# EAGLE design RFBoardLayoutGen0_v03.1routing (EAGLE 7.5.0)
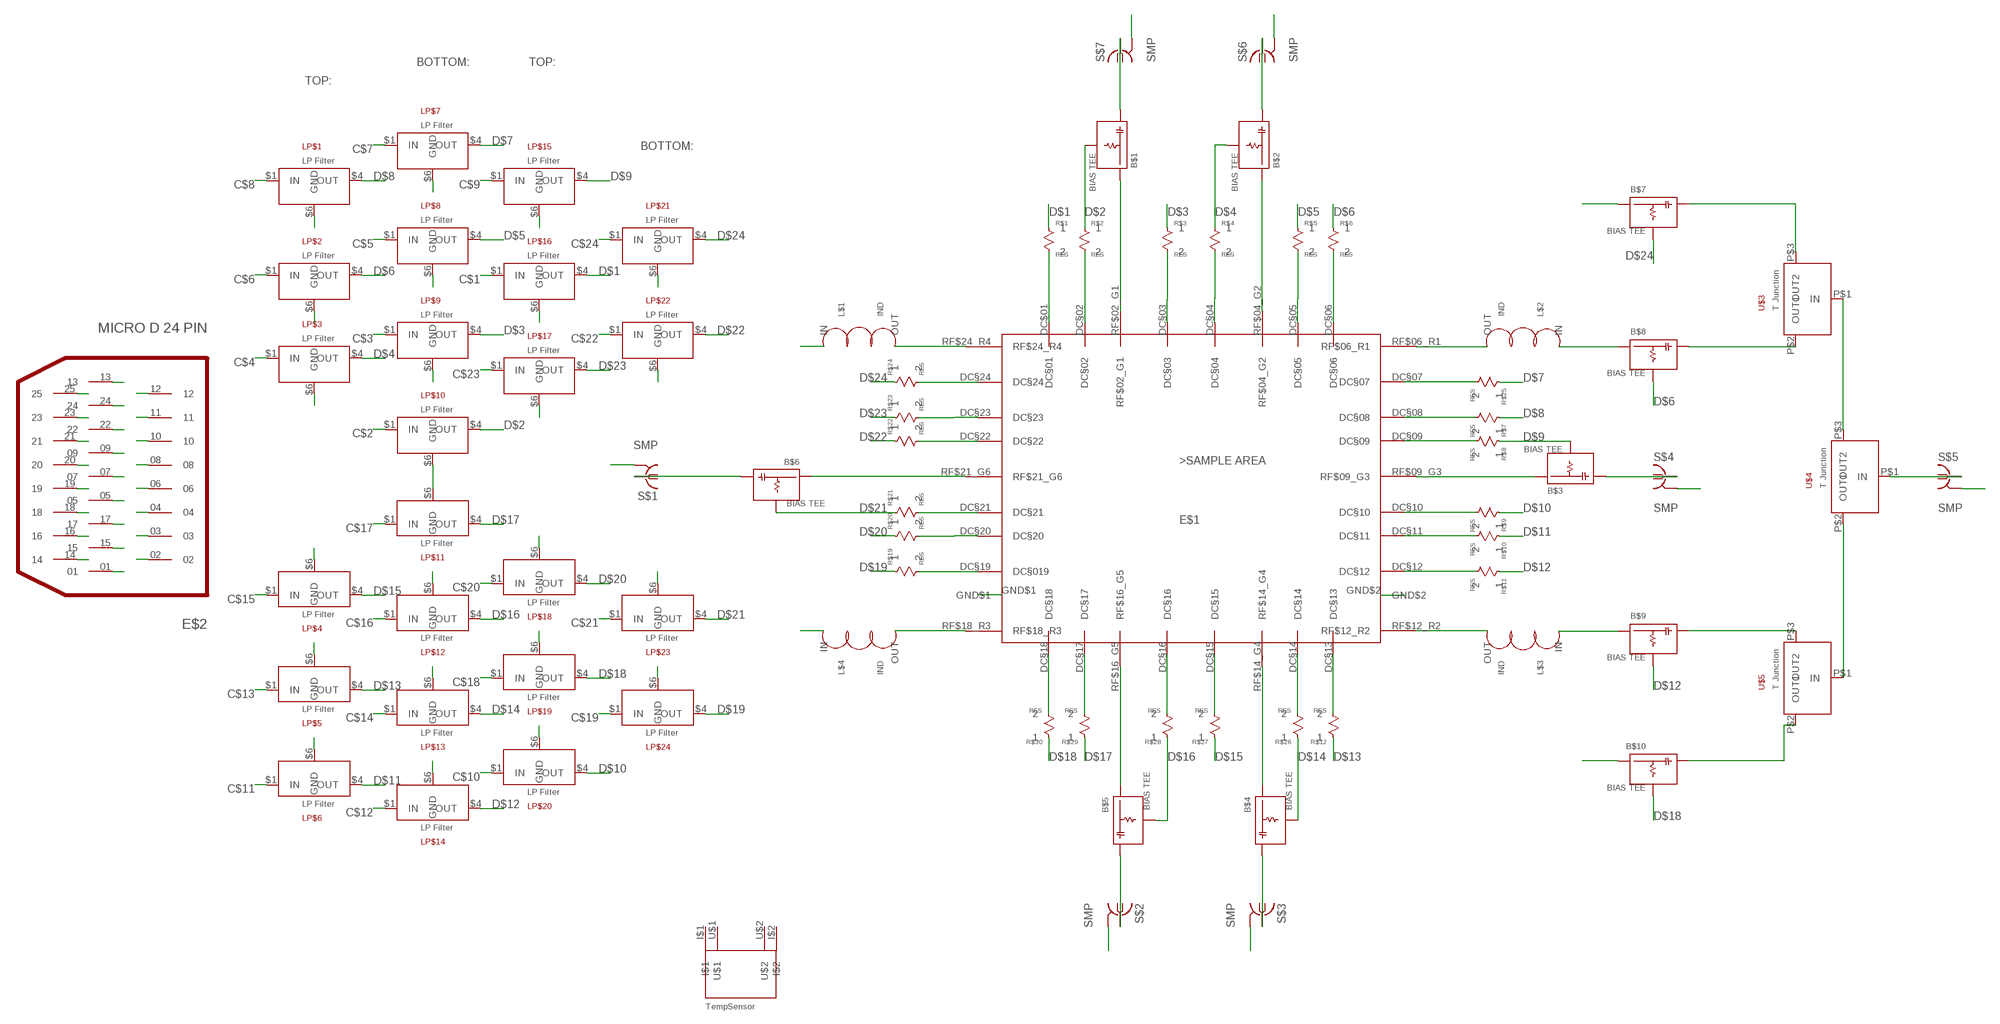
[diagram p0: schematic, sheet 1, part 1 of 2]
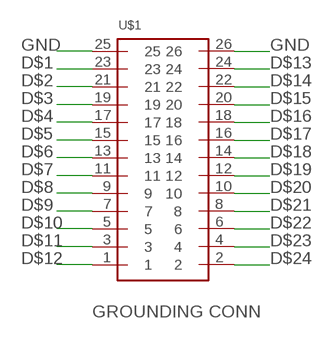
[diagram p1: schematic, sheet 1, part 2 of 2]

## Parts
B$1  BIASTEEDOWN  [BIAS_TEE_DOWN_0603]
B$2  BIASTEEUP  [BIAS_TEE_UP_0603]
B$3  BIASTEEDOWN  [BIAS_TEE_DOWN_0603]
B$4  BIASTEEDOWN  [BIAS_TEE_DOWN_0603]
B$5  BIASTEEUP  [BIAS_TEE_UP_0603]
B$6  BIASTEEDOWN  [BIAS_TEE_DOWN_0603]
B$7  BIASTEEUP  [BIAS_TEE_UP_0603]
B$8  BIASTEEDOWN  [BIAS_TEE_DOWN_0603]
B$9  BIASTEEUP  [BIAS_TEE_UP_0603]
B$10  BIASTEEDOWN  [BIAS_TEE_DOWN_0603]
E$1  24DC+10RF  [24DC+10RF/400MU-PADS/0.7X0.7_V1.0]
E$2  25_SOCKET_M83513(13-DPINOUT2  [25_SOCKET_M83513/13-D_V2]
L$1  L_MATCH  [L_MATCH]
L$2  L_MATCH  [L_MATCH]
L$3  L_MATCH  [L_MATCH]
L$4  L_MATCH  [L_MATCH]
LP$1  LP-FILTER/1-STAGETOP  [LP-FILTER/1_STAGE/OS/0603_TOP]
LP$2  LP-FILTER/1-STAGETOP  [LP-FILTER/1_STAGE/OS/0603_TOP]
LP$3  LP-FILTER/1-STAGETOP  [LP-FILTER/1_STAGE/OS/0603_TOP]
LP$4  LP-FILTER/1-STAGETOP  [LP-FILTER/1_STAGE/OS/0603_TOP]
LP$5  LP-FILTER/1-STAGETOP  [LP-FILTER/1_STAGE/OS/0603_TOP]
LP$6  LP-FILTER/1-STAGETOP  [LP-FILTER/1_STAGE/OS/0603_TOP]
LP$7  LP-FILTER/1-STAGEBOT  [LP-FILTER/1_STAGE/OS/0603_BOTTOM]
LP$8  LP-FILTER/1-STAGEBOT  [LP-FILTER/1_STAGE/OS/0603_BOTTOM]
LP$9  LP-FILTER/1-STAGEBOT  [LP-FILTER/1_STAGE/OS/0603_BOTTOM]
LP$10  LP-FILTER/1-STAGEBOT  [LP-FILTER/1_STAGE/OS/0603_BOTTOM]
LP$11  LP-FILTER/1-STAGEBOT  [LP-FILTER/1_STAGE/OS/0603_BOTTOM]
LP$12  LP-FILTER/1-STAGEBOT  [LP-FILTER/1_STAGE/OS/0603_BOTTOM]
LP$13  LP-FILTER/1-STAGEBOT  [LP-FILTER/1_STAGE/OS/0603_BOTTOM]
LP$14  LP-FILTER/1-STAGEBOT  [LP-FILTER/1_STAGE/OS/0603_BOTTOM]
LP$15  LP-FILTER/1-STAGETOP  [LP-FILTER/1_STAGE/OS/0603_TOP]
LP$16  LP-FILTER/1-STAGETOP  [LP-FILTER/1_STAGE/OS/0603_TOP]
LP$17  LP-FILTER/1-STAGETOP  [LP-FILTER/1_STAGE/OS/0603_TOP]
LP$18  LP-FILTER/1-STAGETOP  [LP-FILTER/1_STAGE/OS/0603_TOP]
LP$19  LP-FILTER/1-STAGETOP  [LP-FILTER/1_STAGE/OS/0603_TOP]
LP$20  LP-FILTER/1-STAGETOP  [LP-FILTER/1_STAGE/OS/0603_TOP]
LP$21  LP-FILTER/1-STAGEBOT  [LP-FILTER/1_STAGE/OS/0603_BOTTOM]
LP$22  LP-FILTER/1-STAGEBOT  [LP-FILTER/1_STAGE/OS/0603_BOTTOM]
LP$23  LP-FILTER/1-STAGEBOT  [LP-FILTER/1_STAGE/OS/0603_BOTTOM]
LP$24  LP-FILTER/1-STAGEBOT  [LP-FILTER/1_STAGE/OS/0603_BOTTOM]
R$1  10K  LP-FILTER/RESISTOR/0603  [LP-FILTER/RESISTOR/0603_BOTTOM]
R$2  10K  LP-FILTER/RESISTOR/0603  [LP-FILTER/RESISTOR/0603_BOTTOM]
R$3  10K  LP-FILTER/RESISTOR/0603  [LP-FILTER/RESISTOR/0603_BOTTOM]
R$4  10K  LP-FILTER/RESISTOR/0603  [LP-FILTER/RESISTOR/0603_BOTTOM]
R$5  10K  LP-FILTER/RESISTOR/0603  [LP-FILTER/RESISTOR/0603_BOTTOM]
R$6  10K  LP-FILTER/RESISTOR/0603  [LP-FILTER/RESISTOR/0603_BOTTOM]
R$7  10K  LP-FILTER/RESISTOR/0603  [LP-FILTER/RESISTOR/0603_BOTTOM]
R$8  10K  LP-FILTER/RESISTOR/0603  [LP-FILTER/RESISTOR/0603_BOTTOM]
R$9  10K  LP-FILTER/RESISTOR/0603  [LP-FILTER/RESISTOR/0603_BOTTOM]
R$10  10K  LP-FILTER/RESISTOR/0603  [LP-FILTER/RESISTOR/0603_BOTTOM]
R$11  10K  LP-FILTER/RESISTOR/0603  [LP-FILTER/RESISTOR/0603_BOTTOM]
R$12  10K  LP-FILTER/RESISTOR/0603  [LP-FILTER/RESISTOR/0603_BOTTOM]
R$19  10K  LP-FILTER/RESISTOR/0603  [LP-FILTER/RESISTOR/0603_BOTTOM]
R$20  10K  LP-FILTER/RESISTOR/0603  [LP-FILTER/RESISTOR/0603_BOTTOM]
R$21  10K  LP-FILTER/RESISTOR/0603  [LP-FILTER/RESISTOR/0603_BOTTOM]
R$22  10K  LP-FILTER/RESISTOR/0603  [LP-FILTER/RESISTOR/0603_BOTTOM]
R$23  10K  LP-FILTER/RESISTOR/0603  [LP-FILTER/RESISTOR/0603_BOTTOM]
R$24  10K  LP-FILTER/RESISTOR/0603  [LP-FILTER/RESISTOR/0603_BOTTOM]
R$25  10K  LP-FILTER/RESISTOR/0603  [LP-FILTER/RESISTOR/0603_BOTTOM]
R$26  10K  LP-FILTER/RESISTOR/0603  [LP-FILTER/RESISTOR/0603_BOTTOM]
R$27  10K  LP-FILTER/RESISTOR/0603  [LP-FILTER/RESISTOR/0603_BOTTOM]
R$28  10K  LP-FILTER/RESISTOR/0603  [LP-FILTER/RESISTOR/0603_BOTTOM]
R$29  10K  LP-FILTER/RESISTOR/0603  [LP-FILTER/RESISTOR/0603_BOTTOM]
R$30  10K  LP-FILTER/RESISTOR/0603  [LP-FILTER/RESISTOR/0603_BOTTOM]
S$1  MC-921  [SMP_STRAIGHT_MINI]
S$2  MC-921  [SMP_STRAIGHT_MINI]
S$3  MC-921  [SMP_STRAIGHT_MINI]
S$4  MC-921  [SMP_STRAIGHT_MINI]
S$5  MC-921  [SMP_STRAIGHT_MINI]
S$6  MC-921  [SMP_STRAIGHT_MINI]
S$7  MC-921  [SMP_STRAIGHT_MINI]
U$1  MEC8-113-02-L-D-RA1MBRD  [MEC8-113-02-L-D-RA1]
U$2  TEMPSENS  [RX-BR_V1]
U$3  TJUNCTION  [T_JUNCTION_0.3MM]
U$4  TJUNCTION  [T_JUNCTION_0.3MM]
U$5  TJUNCTION  [T_JUNCTION_0.3MM]

## Nets
C$1: E$2.01 LP$16.$1(IN)
C$2: E$2.02 LP$10.$1(IN)
C$3: E$2.03 LP$9.$1(IN)
C$4: E$2.04 LP$3.$1(IN)
C$5: E$2.05 LP$8.$1(IN)
C$6: E$2.06 LP$2.$1(IN)
C$7: E$2.07 LP$7.$1(IN)
C$8: E$2.08 LP$1.$1(IN)
C$9: E$2.09 LP$15.$1(IN)
C$10: E$2.10 LP$20.$1(IN)
C$11: E$2.11 LP$6.$1(IN)
C$12: E$2.12 LP$14.$1(IN)
C$13: E$2.13 LP$5.$1(IN)
C$14: E$2.14 LP$13.$1(IN)
C$15: E$2.15 LP$4.$1(IN)
C$16: E$2.16 LP$12.$1(IN)
C$17: E$2.17 LP$11.$1(IN)
C$18: E$2.18 LP$19.$1(IN)
C$19: E$2.19 LP$24.$1(IN)
C$20: E$2.20 LP$18.$1(IN)
C$21: E$2.21 LP$23.$1(IN)
C$22: E$2.22 LP$22.$1(IN)
C$23: E$2.23 LP$17.$1(IN)
C$24: E$2.24 LP$21.$1(IN)
D$1: LP$16.$4(OUT) R$1.IN U$1.23
D$2: B$1.LF LP$10.$4(OUT) R$2.IN U$1.21
D$3: LP$9.$4(OUT) R$3.IN U$1.19
D$4: B$2.LF LP$3.$4(OUT) R$4.IN U$1.17
D$5: LP$8.$4(OUT) R$5.IN U$1.15
D$6: B$8.LF LP$2.$4(OUT) R$6.IN U$1.13
D$7: LP$7.$4(OUT) R$25.IN U$1.11
D$8: LP$1.$4(OUT) R$7.IN U$1.9
D$9: B$3.LF LP$15.$4(OUT) R$8.IN U$1.7
D$10: LP$20.$4(OUT) R$9.IN U$1.5
D$11: LP$6.$4(OUT) R$10.IN U$1.3
D$12: B$9.LF LP$14.$4(OUT) R$11.IN U$1.1
D$13: LP$5.$4(OUT) R$12.IN U$1.24
D$14: B$4.LF LP$13.$4(OUT) R$26.IN U$1.22
D$15: LP$4.$4(OUT) R$27.IN U$1.20
D$16: B$5.LF LP$12.$4(OUT) R$28.IN U$1.18
D$17: LP$11.$4(OUT) R$29.IN U$1.16
D$18: B$10.LF LP$19.$4(OUT) R$30.IN U$1.14
D$19: LP$24.$4(OUT) R$19.IN U$1.12
D$20: LP$18.$4(OUT) R$20.IN U$1.10
D$21: B$6.LF LP$23.$4(OUT) R$21.IN U$1.8
D$22: LP$22.$4(OUT) R$22.IN U$1.6
D$23: LP$17.$4(OUT) R$23.IN U$1.4
D$24: B$7.LF LP$21.$4(OUT) R$24.IN U$1.2
DC$1: E$1.DC$01(DC§01) R$1.OUT
DC$2: E$1.DC§02 R$2.OUT
DC$3: E$1.DC§03 R$3.OUT
DC$4: E$1.DC§04 R$4.OUT
DC$5: E$1.DC§05 R$5.OUT
DC$6: E$1.DC§06 R$6.OUT
DC$7: E$1.DC§07 R$25.OUT
DC$8: E$1.DC§08 R$7.OUT
DC$9: E$1.DC§09 R$8.OUT
DC$10: E$1.DC§10 R$9.OUT
DC$11: E$1.DC§11 R$10.OUT
DC$12: E$1.DC§12 R$11.OUT
DC$13: E$1.DC§13 R$12.OUT
DC$14: E$1.DC§14 R$26.OUT
DC$15: E$1.DC§15 R$27.OUT
DC$16: E$1.DC§16 R$28.OUT
DC$17: E$1.DC§17 R$29.OUT
DC$18: E$1.DC§18 R$30.OUT
DC$19: E$1.DC§19(DC§019) R$19.OUT
DC$20: E$1.DC§20 R$20.OUT
DC$21: E$1.DC§21 R$21.OUT
DC$22: E$1.DC§22 R$22.OUT
DC$23: E$1.DC§23 R$23.OUT
DC$24: E$1.DC§24 R$24.OUT
GND: E$1.GND$1 E$1.GND$2 E$2.25 LP$1.$6(GND) LP$2.$6(GND) LP$3.$6(GND) LP$4.$6(GND) LP$5.$6(GND) LP$6.$6(GND) LP$7.$6(GND) LP$8.$6(GND) LP$9.$6(GND) LP$10.$6(GND) LP$11.$6(GND) LP$12.$6(GND) LP$13.$6(GND) LP$14.$6(GND) LP$15.$6(GND) LP$16.$6(GND) LP$17.$6(GND) LP$18.$6(GND) LP$19.$6(GND) LP$20.$6(GND) LP$21.$6(GND) LP$22.$6(GND) LP$23.$6(GND) LP$24.$6(GND) S$1.2@1(GND) S$1.2@2(GND) S$2.2@1(GND) S$2.2@2(GND) S$3.2@1(GND) S$3.2@2(GND) S$4.2@1(GND) S$4.2@2(GND) S$5.2@1(GND) S$5.2@2(GND) S$6.2@1(GND) S$6.2@2(GND) S$7.2@1(GND) S$7.2@2(GND) U$1.25 U$1.26
N$1: B$6.HF S$1.1
N$2: E$1.RF$12_R2 L$3.OUT
N$3 [RF]: B$1.OUT E$1.RF$02_G1
N$4 [RF]: B$2.OUT E$1.RF$04_G2
N$5 [RF]: B$1.HF S$7.1
N$6 [RF]: B$2.HF S$6.1
N$7 [RF]: B$5.OUT E$1.RF$16_G5
N$8 [RF]: B$4.OUT E$1.RF$14_G4
N$9 [RF]: E$1.RF$18_R3 L$4.OUT
N$10 [RF]: E$1.RF$24_R4 L$1.OUT
N$11 [RF]: E$1.RF$06_R1 L$2.OUT
N$12: B$3.OUT E$1.RF$09_G3
N$13 [RF]: B$9.OUT L$3.IN
N$14 [RF]: B$8.OUT L$2.IN
N$15 [RF]: B$9.HF U$5.P$3(OUT2)
N$16 [RF]: B$5.HF S$2.1
N$17 [RF]: B$4.HF S$3.1
N$18: B$3.HF S$4.1
N$19 [RF]: B$7.HF U$3.P$3(OUT2)
N$20: B$6.OUT E$1.RF$21_G6
N$21 [RF]: S$5.1 U$4.P$1(IN)
N$22 [RF]: B$10.HF U$5.P$2(OUT1)
N$23 [RF]: B$8.HF U$3.P$2(OUT1)
N$25: U$3.P$1(IN) U$4.P$3(OUT2)
N$26: U$4.P$2(OUT1) U$5.P$1(IN)
RF$3 [RF]: B$10.OUT L$4.IN
RF$4 [RF]: B$7.OUT L$1.IN
Unconnected: U$2.I$1 U$2.I$2 U$2.U$1 U$2.U$2

## Notes on the sheet
- BOTTOM: | TOP:
- TOP:
- BOTTOM:

## Library data of the parts
B$1-B$10 = Bias tee:BIASTEE
E$1 = SampleArea:24DC+10RF
E$2 = Glenair:25_SOCKET_M83513(13-D
L$1-L$4 = MatchCircuit:L_MATCH
LP$1-LP$24 = LPFilter:LP-FILTER/1-STAGE
R$1-R$12 R$19-R$30 = LPFilter:LP-FILTER/RESISTOR/0603
S$1-S$7 = RF Connectors:MC-921: COAX. MICROWAVE CONNECTOR O/D diam 2.1 Source: www.tycoelectronics.com .. Electronics .. ENG_CD_1775146_A2.pdf
U$1 = MEC8-130-02-X-D-RA1:MEC8-113-02-L-D-RA1
U$2 = TempSensors:TEMPSENS
U$3-U$5 = RF layout parts:TJUNCTION

## Net classes
0 GND: clearance 0.15 mm
1 RF: clearance 2 mm

## Board
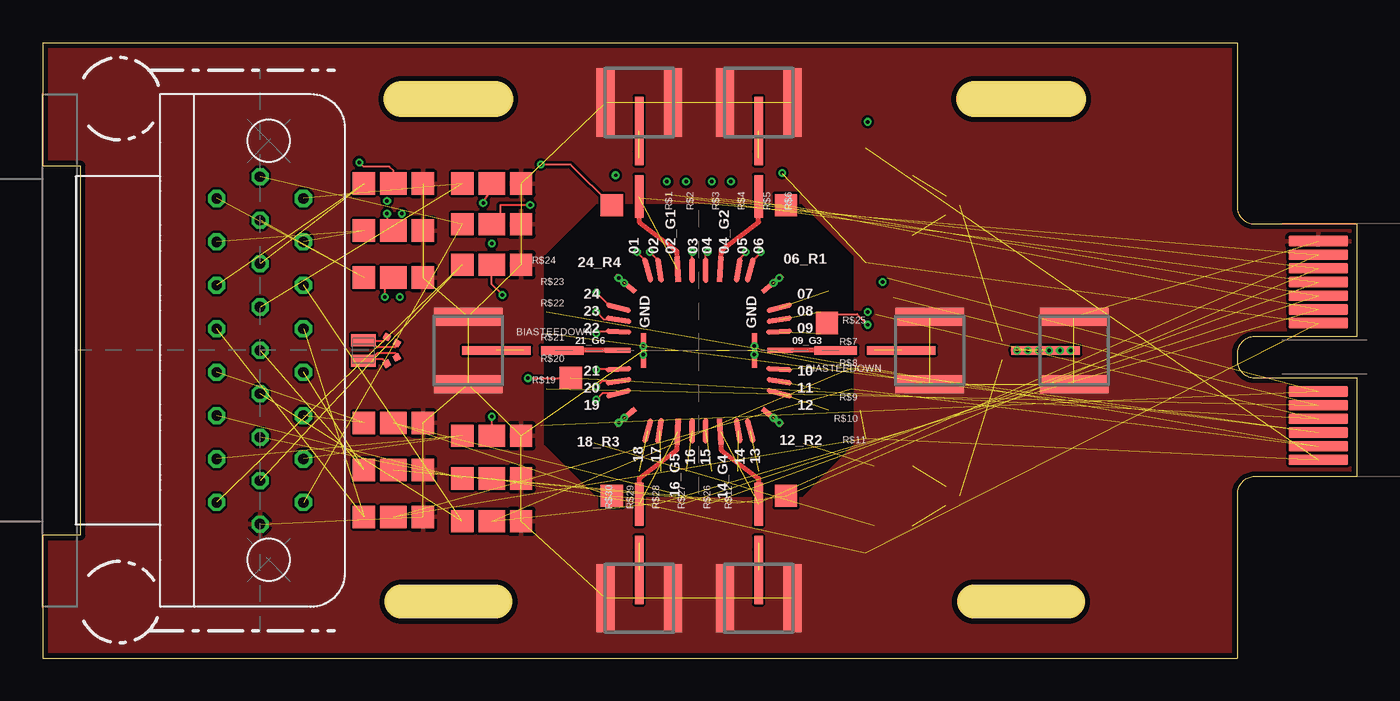
[diagram p2: board, top side]
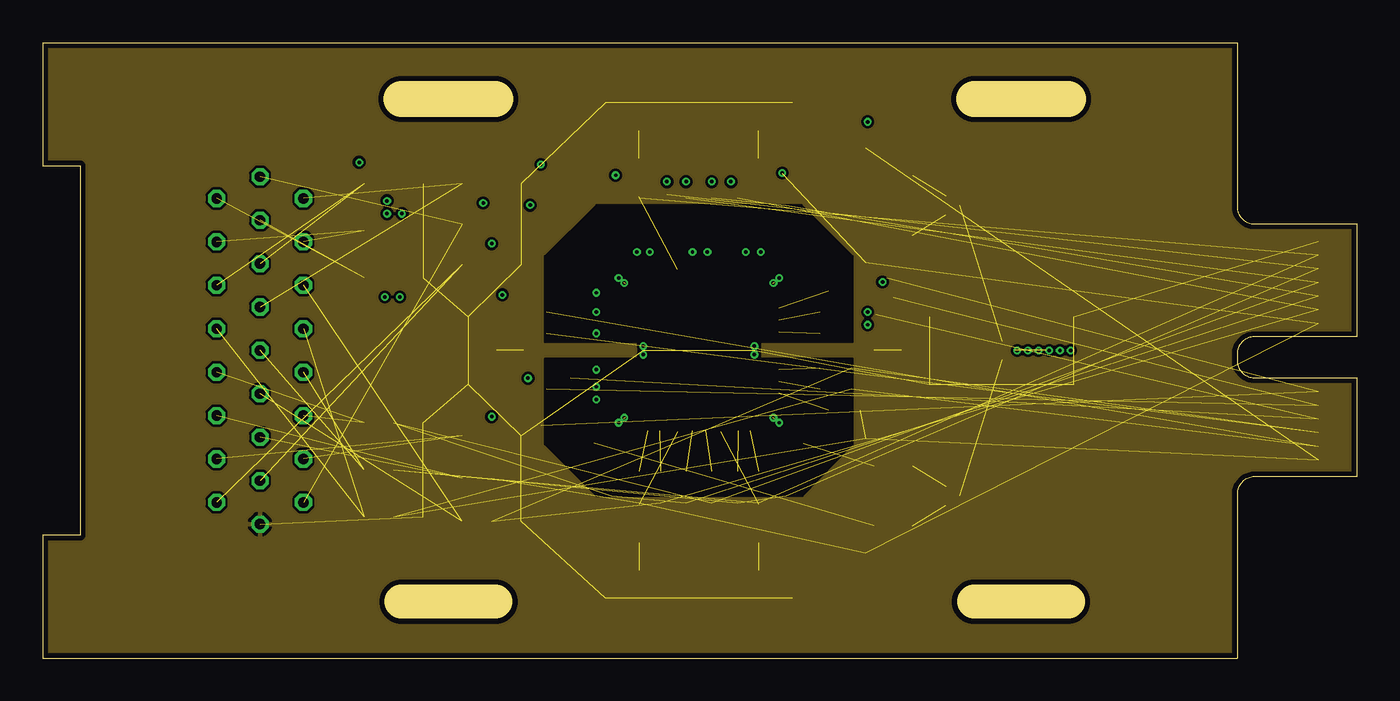
[diagram p3: board, inner layer Route2]
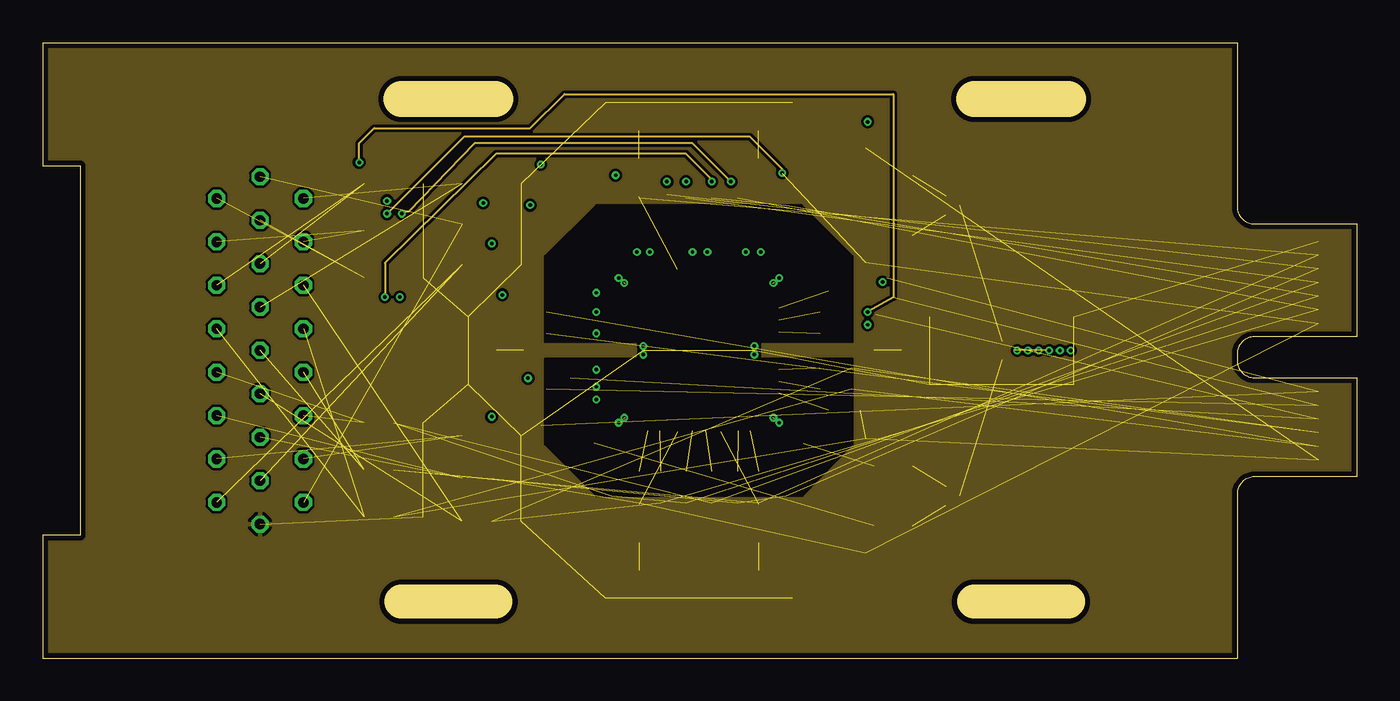
[diagram p4: board, inner layer Route3]
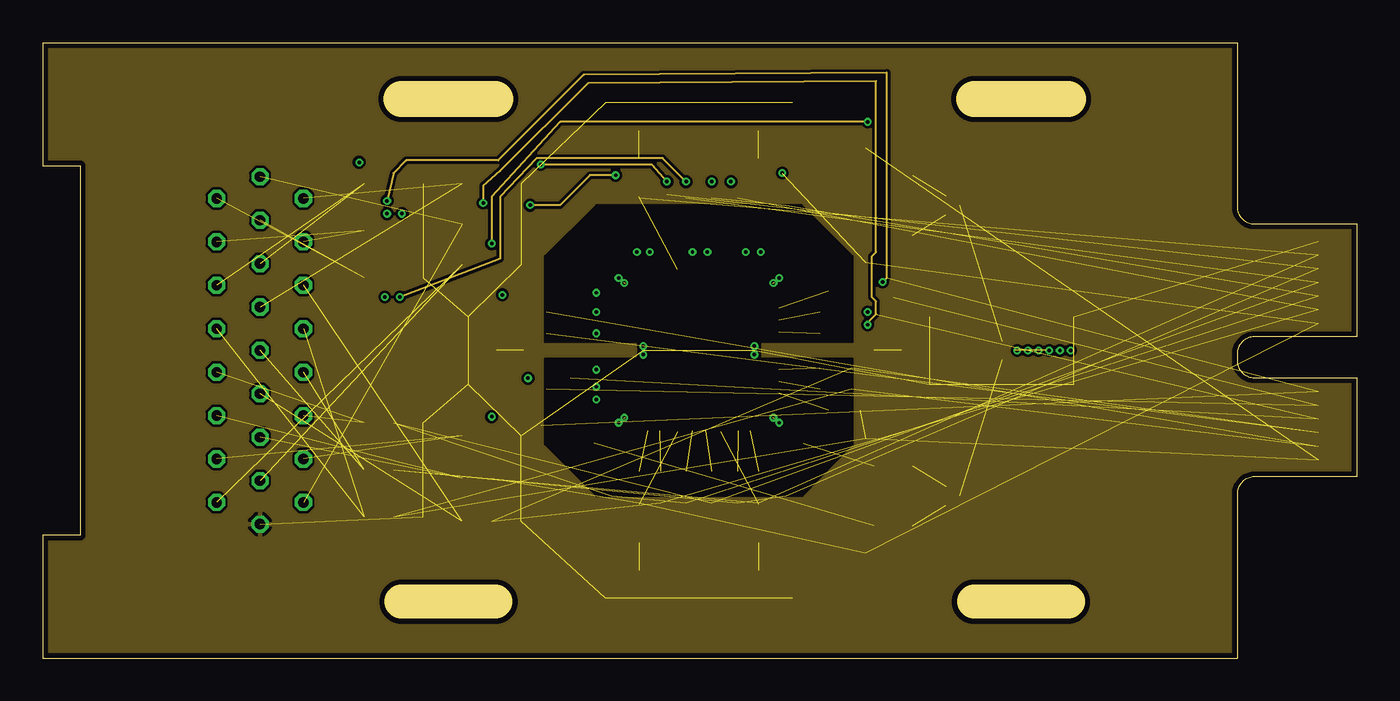
[diagram p5: board, inner layer Route14]
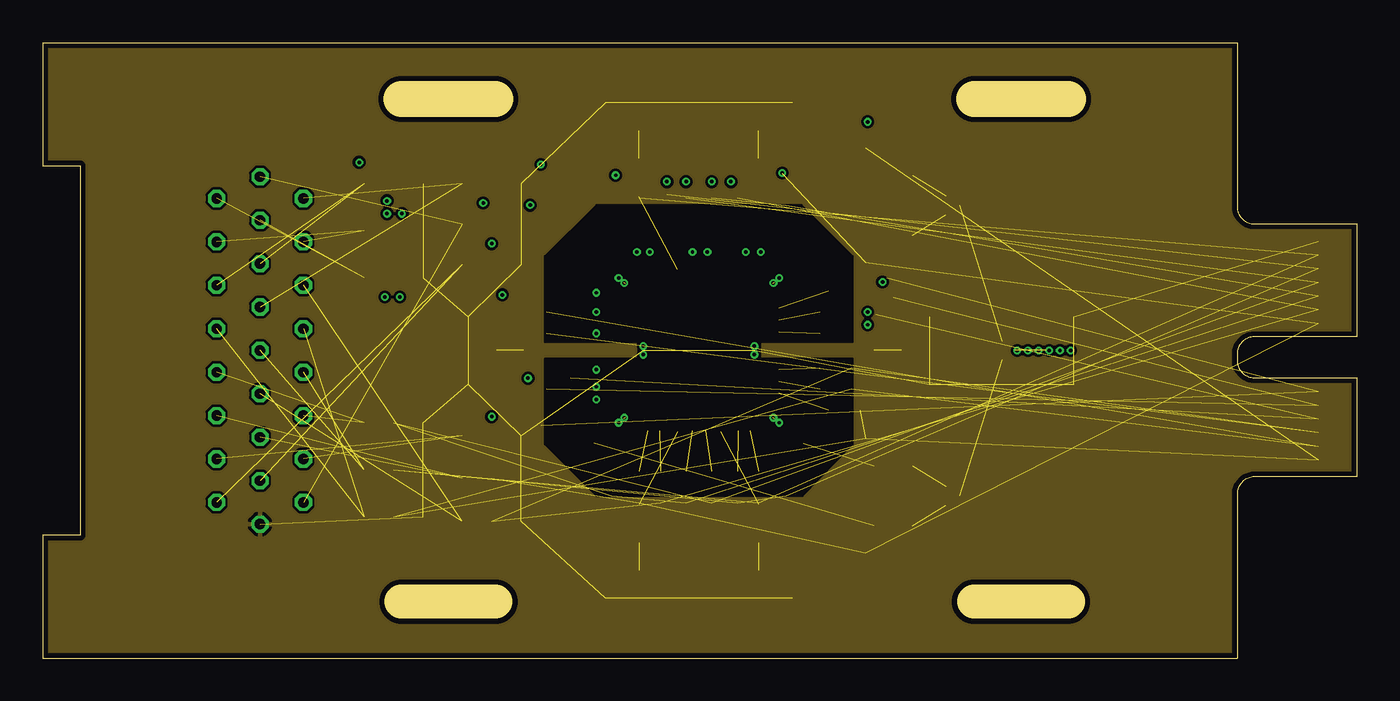
[diagram p6: board, inner layer Route15]
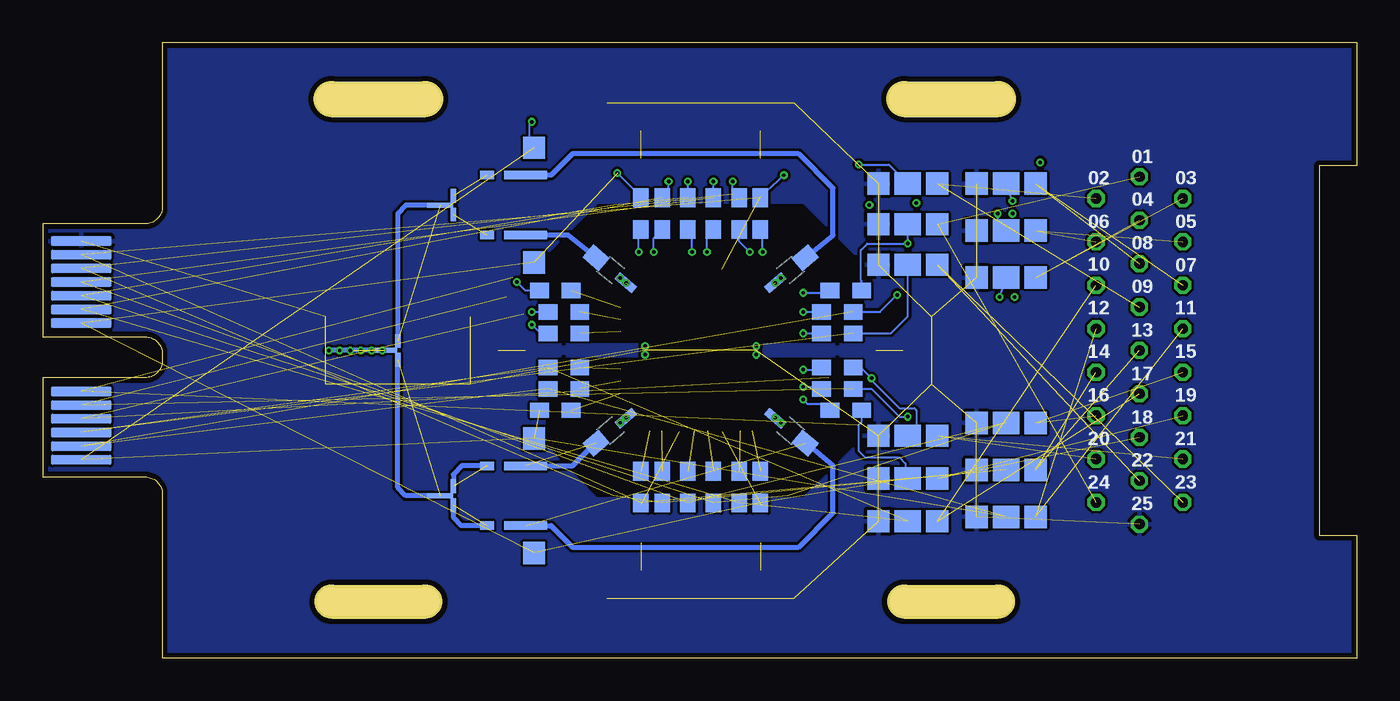
[diagram p7: board, bottom side, seen from below]

Size 76.9 x 36 mm. Coordinates in mm from the lower left corner, seen from the top.
Outline: 26.5,3.3 21,3.3
Outline: 26.5,32.7 21,32.7
Outline: 60,32.7 54.5,32.7
Outline: 60,3.3 54.5,3.3
Outline: 0,36 0,28.8 2.2,28.8 2.2,7.2 0,7.2 0,0 69.9,0 69.9,9.6 arc-90 70.9,10.6 76.9,10.6 76.9,16.4 70.9,16.4 arc-90 69.9,17.4 69.9,17.8 arc-90 70.9,18.8 76.9,18.8 76.9,25.4 70.9,25.4 arc-90 69.9,26.4 69.9,36 0,36
Copper layers (1+2+3*14+15+16): Top 0.035mm / dielectric 0.2mm / Route2 0.035mm / dielectric 0.36mm / Route3 0.035mm / dielectric 0.28mm / Route14 0.035mm / dielectric 0.36mm / Route15 0.035mm / dielectric 0.2mm / Bottom 0.035mm
Design rules "PCB-POOL HighSpec_ML6+": minimum track width 0.125mm, minimum drill 0.2mm, track to track 0.125mm, track to pad 0.125mm, pad to pad 0.125mm, via to via 0.125mm, smd to smd 0.125mm, copper to edge 0.3mm, drill to drill 0.2mm, minimum pad ring 0.2mm, minimum via ring 0.125mm, stop-mask expansion 0.075mm, vias tented up to drill 0.3mm, thermal gap 0.2mm

### Footprints (pad centres in the part's own frame; a part is rotated, then mirrored left to right if it is on the bottom)
BIAS_TEE_DOWN_0603 = smd 0.8 x 0.5: HF 2.75,0 | smd 1.3 x 1.3: LF 0,1.6 | smd 2.5 x 0.5: OUT 0.5,0
BIAS_TEE_UP_0603 = smd 0.8 x 0.5: HF 2.75,0 | smd 1.3 x 1.3: LF 0,-1.6 | smd 2.5 x 0.5: OUT 0.5,0
24DC+10RF/400MU-PADS/0.7X0.7_V1.0 = smd 1.5 x 0.3 rotated 105: DC$01 -3,4.7 | smd 1.5 x 0.3 rotated 99: DC§02 -2.3,4.7 | smd 0.3 x 1.5: DC§03 -0.4,4.7; DC§04 0.4,4.7; DC§15 0.4,-4.7; DC§16 -0.4,-4.7 | smd 1.5 x 0.3 rotated 81: DC§05 2.3,4.7 | smd 1.5 x 0.3 rotated 75: DC§06 3,4.7 | smd 1.5 x 0.3 rotated 195: DC§07 4.7,2.5 | smd 1.5 x 0.3 rotated 189: DC§08 4.7,1.8 | smd 1.5 x 0.3 rotated 183: DC§09 4.7,1.1 | smd 1.5 x 0.3 rotated 177: DC§10 4.7,-1.1 | smd 1.5 x 0.3 rotated 171: DC§11 4.7,-1.8 | smd 1.5 x 0.3 rotated 165: DC§12 4.7,-2.5 | smd 1.5 x 0.3 rotated 285: DC§13 3,-4.7 | smd 1.5 x 0.3 rotated 279: DC§14 2.3,-4.7 | smd 1.5 x 0.3 rotated 261: DC§17 -2.3,-4.7 | smd 1.5 x 0.3 rotated 255: DC§18 -3,-4.7 | smd 1.5 x 0.3 rotated 15: DC§19 -4.7,-2.5 | smd 1.5 x 0.3 rotated 9: DC§20 -4.7,-1.8 | smd 1.5 x 0.3 rotated 3: DC§21 -4.7,-1.1 | smd 1.5 x 0.3 rotated 357: DC§22 -4.7,1.1 | smd 1.5 x 0.3 rotated 351: DC§23 -4.7,1.8 | smd 1.5 x 0.3 rotated 345: DC§24 -4.7,2.5 | smd 0.3 x 2: GND$1 -3.25,0; GND$2 3.25,0 | smd 1.5 x 0.3 rotated 93: RF$02_G1 -1.25,4.75 | smd 1.5 x 0.3 rotated 87: RF$04_G2 1.25,4.75 | smd 1.5 x 0.3 rotated 40: RF$06_R1 4.3,3.9; RF$18_R3 -4.3,-3.9 | smd 1.5 x 0.3: RF$09_G3 4.75,0; RF$21_G6 -4.75,0 | smd 1.5 x 0.3 rotated 140: RF$12_R2 4.3,-3.9; RF$24_R4 -4.3,3.9 | smd 1.5 x 0.3 rotated 273: RF$14_G4 1.25,-4.75 | smd 1.5 x 0.3 rotated 267: RF$16_G5 -1.25,-4.75
25_SOCKET_M83513/13-D_V2 = drill 0.6 octagon: 01 10.16,0; 02 8.89,-2.54; 03 8.89,2.54; 04 7.62,0; 05 6.35,2.54; 06 6.35,-2.54; 07 3.81,2.54; 08 5.08,0; 09 2.54,0; 10 3.81,-2.54; 11 1.27,2.54; 12 1.27,-2.54; 13 0,0; 14 -1.27,-2.54; 15 -1.27,2.54; 16 -3.81,-2.54; 17 -2.54,0; 18 -5.08,0; 19 -3.81,2.54; 20 -6.35,-2.54; 21 -6.35,2.54; 22 -7.62,0; 23 -8.89,2.54; 24 -8.89,-2.54; 25 -10.16,0
SMD0.8-0,5 = smd 0.8 x 0.5: 1 0,0
L_MATCH = smd 1.25 x 1: IN 1.125,0 | smd 1.3 x 0.5: OUT -1.15,0
LP-FILTER/1_STAGE/OS/0603_TOP = smd 1.3 x 1.3: $1 -1.6,0.01; $6 1.85,0.01 | smd 1.55 x 1.3: $4 0.125,0.01
LP-FILTER/1_STAGE/OS/0603_BOTTOM = smd 1.3 x 1.3 bottom: $1 -1.6,0.01; $6 1.85,0.01 | smd 1.55 x 1.3 bottom: $4 0.125,0.01
LP-FILTER/RESISTOR/0603_BOTTOM = smd 1.1 x 0.9 bottom: IN -0.925,0; OUT 0.925,0
SMP_STRAIGHT_MINI = smd 0.5 x 4: 1 0,1.653 | smd 1.05 x 4: 2@1 -1.975,0; 2@2 1.975,0
MEC8-113-02-L-D-RA1 = smd 0.6 x 3.5: 1 6.4,0.15; 3 5.6,0.15; 5 4.8,0.15; 7 4,0.15; 9 3.2,0.15; 11 2.4,0.15; 13 -1.6,0.15; 15 -2.4,0.15; 17 -3.2,0.15; 19 -4,0.15; 21 -4.8,0.15; 23 -5.6,0.15; 25 -6.4,0.15 | smd 0.6 x 3.5 bottom: 2 6.4,0.15; 4 5.6,0.15; 6 4.8,0.15; 8 4,0.15; 10 3.2,0.15; 12 2.4,0.15; 14 -1.6,0.15; 16 -2.4,0.15; 18 -3.2,0.15; 20 -4,0.15; 22 -4.8,0.15; 24 -5.6,0.15; 26 -6.4,0.15
RX-BR_V1 = smd 0.406 x 0.406 rotated 105: I$1 -0.02,1.08; U$1 0.63,1.23 | smd 0.406 x 0.406 rotated 165: I$2 1.08,-0.02; U$2 1.23,0.63 | smd 1.422 x 0.711 rotated 45: P$2 -0.02,-0.87; P$3 -0.87,-0.02
T_JUNCTION_0.3MM = smd 0.3 x 1.5 bottom: P$1 0,-0.75 | smd 0.8 x 0.3 bottom: P$2 -0.55,0.03; P$3 0.55,0.03 | smd 1 x 0.125 bottom: P$4 0,-0.06

### Placement (x,y rotation side)
B$1  34.9,26.5 90 top
B$2  41.9,26.5 90 top
B$3  45.9,18 0 top
B$4  41.9,9.5 270 top
B$5  34.9,9.5 270 top
B$6  30.9,18 180 top
B$7  48.15,28.25 180 bottom
B$8  48.15,24.75 180 bottom
B$9  48.15,11.25 180 bottom
B$10  48.15,7.75 180 bottom
E$1  38.4,18 0 top
E$2  12.71,18 90 top
E$30  [SMD0.8-0,5]  50.9,11.25 0 bottom
L$1  33.14,22.7 40 bottom
L$2  43.66,22.7 140 bottom
L$3  43.66,13.3 220 bottom
L$4  33.14,13.3 320 bottom
LP$1  20.4,27.75 0 top
LP$2  20.4,25 0 top
LP$3  20.4,22.25 0 top
LP$4  20.4,13.75 0 top
LP$5  20.4,11 0 top
LP$6  20.4,8.25 0 top
LP$7  20.4,27.75 0 top
LP$8  20.4,25 0 top
LP$9  20.4,22.25 0 top
LP$10  26.15,27.75 0 top
LP$11  26.15,8 0 top
LP$12  20.4,13.75 0 top
LP$13  20.4,11 0 top
LP$14  20.4,8.25 0 top
LP$15  26.15,27.75 0 top
LP$16  26.15,25.38 0 top
LP$17  26.15,23 0 top
LP$18  26.15,13 0 top
LP$19  26.15,10.5 0 top
LP$20  26.15,8 0 top
LP$21  26.15,25.38 0 top
LP$22  26.15,23 0 top
LP$23  26.15,13 0 top
LP$24  26.15,10.5 0 top
R$1  34.9,26 270 top
R$2  36.15,26 270 top
R$3  37.65,26 270 top
R$4  39.15,26 270 top
R$5  40.65,26 270 top
R$6  41.9,26 270 top
R$7  46.4,20.25 180 top
R$8  46.4,19 180 top
R$9  46.4,17 180 top
R$10  46.4,15.75 180 top
R$11  46.9,14.5 180 top
R$12  41.9,10 90 top
R$19  29.9,14.5 0 top
R$20  30.4,15.75 0 top
R$21  30.4,17 0 top
R$22  30.4,19 0 top
R$23  30.4,20.25 0 top
R$24  29.9,21.5 0 top
R$25  46.9,21.5 180 top
R$26  40.65,10 90 top
R$27  39.15,10 90 top
R$28  37.65,10 90 top
R$29  36.15,10 90 top
R$30  34.9,10 90 top
S$1  24.9,18 270 top
S$2  34.9,3.5 0 top
S$3  41.9,3.5 0 top
S$4  51.9,18 90 top
S$5  60.35,18 90 top
S$6  41.9,32.5 180 top
S$7  34.9,32.5 180 top
U$1  74.5,18 270 top
U$2  19.4,18 315 top
U$3  52.9,26.5 90 top
U$4  56.15,18 90 top
U$5  52.9,9.5 90 top

### Tracks (layer width: path | path; a pad name or v marks a point on that pad's centre or on a via)
C$1  (1 unrouted)
C$2  (1 unrouted)
C$3  (1 unrouted)
C$4  (1 unrouted)
C$5  (1 unrouted)
C$6  (1 unrouted)
C$7  (1 unrouted)
C$8  (1 unrouted)
C$9  (1 unrouted)
C$10  (1 unrouted)
C$11  (1 unrouted)
C$12  (1 unrouted)
C$13  (1 unrouted)
C$14  (1 unrouted)
C$15  (1 unrouted)
C$16  (1 unrouted)
C$17  (1 unrouted)
C$18  (1 unrouted)
C$19  (1 unrouted)
C$20  (1 unrouted)
C$21  (1 unrouted)
C$22  (1 unrouted)
C$23  (1 unrouted)
C$24  (1 unrouted)
D$1  (via drill 0.2)  (1 unrouted)
  Top 0.125: v28.52,26.5 26.77,26.5 26.77,26.01 LP$16.$4
  Route14 0.125: v33.52,28.25 32.02,28.25 30.27,26.5 v28.52,26.5
  Bottom 0.125: R$1.IN 34.9,27 v33.52,28.25
D$2  (via drill 0.2)  (1 unrouted)
  Top 0.125: B$1.LF 33.27,26.5 30.9,28.88 v29.15,28.88
  Route14 0.125: v36.52,27.88 35.65,28.88 v29.15,28.88
  Bottom 0.125: R$2.IN 36.32,26.93 36.52,27.12 v36.52,27.88 | v29.15,28.88 27.39,28.88 LP$10.$4
D$3  (via drill 0.2)  (1 unrouted)
  Route14 0.125: v37.65,27.88 36.27,29.25 28.9,29.25 26.77,27 26.77,23.38 v20.9,21.12
  Bottom 0.125: R$3.IN v37.65,27.88 | v20.9,21.12 LP$9.$4
D$4  (via drill 0.2)  (2 unrouted)
  Top 0.125: v20.02,21.12 20.02,22.76 LP$3.$4
  Route3 0.125: v39.15,27.88 39.15,28 37.65,29.5 26.52,29.5 20.02,23.12 v20.02,21.12
  Bottom 0.125: R$4.IN v39.15,27.88
D$5  (via drill 0.2)  (1 unrouted)
  Route3 0.125: v40.27,27.88 38.02,30.12 25.27,30.12 21.4,26.12 21.15,26.12 v21.02,26
  Bottom 0.125: R$5.IN 40.6,26.93 40.27,27.25 v40.27,27.88 | v21.02,26 21.02,25.51 LP$8.$4
D$6  (via drill 0.2)  (2 unrouted)
  Top 0.125: v20.15,26 20.15,25.38 LP$2.$4
  Route3 0.125: v43.27,28.38 43.27,28.62 41.4,30.5 24.65,30.5 v20.15,26
  Bottom 0.125: R$6.IN 41.9,27 v43.27,28.38
D$7  (via drill 0.2)  (1 unrouted)
  Route14 0.125: v49.15,22 49.4,22.25 49.4,34.25 31.65,34.12 26.65,29.12 21.27,29.12 20.52,28.38 v20.15,26.75
  Bottom 0.125: R$25.IN 48.65,21.5 v49.15,22 | v20.15,26.75 LP$7.$4
D$8  (via drill 0.2)  (1 unrouted)
  Top 0.125: LP$1.$4 20.52,28.5 20.27,28.75 18.77,28.75 v18.52,29
  Route3 0.125: v18.52,29 18.52,30.12 19.4,31 28.52,31 30.52,33 49.77,33 49.77,21.12 v48.27,20.25
  Bottom 0.125: v48.27,20.25 R$7.IN
D$9  (via drill 0.2)  (1 unrouted)
  Top 0.125: v25.77,26.62 26.77,28.26 LP$15.$4 | B$3.LF 45.9,19.62 46.4,20.12 47.65,20.12 v48.27,19.5
  Route14 0.125: v48.27,19.5 48.27,19.62 48.77,20.12 48.77,20.88 48.52,21.12 48.52,23.5 48.77,23.75 48.77,33.75 31.9,33.62 26.77,28.5 25.77,27.62 v25.77,26.62
  Bottom 0.125: R$8.IN 47.77,19 v48.27,19.5
D$10  (2 unrouted)
D$11  (2 unrouted)
D$12  (3 unrouted)
D$13  (2 unrouted)
D$14  (3 unrouted)
D$15  (2 unrouted)
D$16  (3 unrouted)
D$17  (2 unrouted)
D$18  (3 unrouted)
D$19  (1 unrouted)
  Bottom 0.125: R$19.IN 28.97,13.8 29.15,13.62 29.15,12.12 28.77,11.75 26.77,11.75 26.4,11.38 26.4,10.63 LP$24.$4
D$20  (via drill 0.2)  (1 unrouted)
  Top 0.125: v26.27,14.12 LP$18.$4
  Bottom 0.125: R$20.IN 28.4,15.75 26.77,14.12 v26.27,14.12
D$21  (via drill 0.2)  (1 unrouted)
  Top 0.125: v28.4,16.38 30.17,16.38 B$6.LF
  Bottom 0.125: LP$23.$4 25.77,13.51 25.77,14.5 25.9,14.62 26.77,14.62 28.4,16.25 v28.4,16.38 29.02,17 R$21.IN
D$22  (1 unrouted)
  Bottom 0.125: R$22.IN 27.27,19 26.27,20 LP$22.$4
D$23  (via drill 0.2)  (1 unrouted)
  Top 0.125: v26.9,21.25 26.27,21.88 LP$17.$4
  Bottom 0.125: R$23.IN 27.9,20.25 v26.9,21.25
D$24  (via drill 0.2)  (1 unrouted)
  Route14 0.125: v48.27,31.38 30.27,31.38 26.27,27 v26.27,24.25
  Bottom 0.125: R$24.IN 28.97,22.07 29.02,22.12 29.02,23.88 28.65,24.25 v26.27,24.25 LP$21.$4 | B$7.LF 48.15,30 48.4,30.25 48.4,31.25 v48.27,31.38
DC$1  (via drill 0.2)
  Top 0.125: E$1.DC$01 35.4,23.12 v34.77,23.75
  Bottom 0.125: v34.77,23.75 34.77,24.95 R$1.OUT
DC$2  (via drill 0.2)
  Top 0.125: E$1.DC§02 36.1,23.18 v35.52,23.75
  Bottom 0.125: v35.52,23.75 36.15,24.38 R$2.OUT
DC$3  (via drill 0.2)
  Top 0.125: E$1.DC§03 38,23.73 v38.02,23.75
  Bottom 0.125: v38.02,23.75 38.02,24.7 R$3.OUT
DC$4  (via drill 0.2)
  Top 0.125: E$1.DC§04 38.8,23.65 v38.9,23.75
  Bottom 0.125: v38.9,23.75 38.9,24.82 R$4.OUT
DC$5  (via drill 0.2)
  Top 0.125: E$1.DC§05 40.7,23.18 v41.15,23.75
  Bottom 0.125: v41.15,23.75 41.15,24.57 R$5.OUT
DC$6  (via drill 0.2)
  Top 0.125: E$1.DC§06 41.4,23 v42.02,23.75
  Bottom 0.125: v42.02,23.75 42.02,24.95 R$6.OUT
DC$7  (1 unrouted)
DC$8  (1 unrouted)
DC$9  (1 unrouted)
DC$10  (1 unrouted)
DC$11  (1 unrouted)
DC$12  (1 unrouted)
DC$13  (1 unrouted)
DC$14  (1 unrouted)
DC$15  (1 unrouted)
DC$16  (1 unrouted)
DC$17  (1 unrouted)
DC$18  (1 unrouted)
DC$19  (via drill 0.2)
  Top 0.125: E$1.DC§19 32.77,15.5 v32.4,15.12
  Bottom 0.125: v32.4,15.12 32.15,14.88 31.2,14.88 R$19.OUT
DC$20  (via drill 0.2)
  Top 0.125: E$1.DC§20 32.73,16.2 v32.4,15.88
  Bottom 0.125: v32.4,15.88 31.45,15.88 R$20.OUT
DC$21  (via drill 0.2)
  Top 0.125: E$1.DC§21 32.42,16.9 v32.4,16.88
  Bottom 0.125: v32.4,16.88 31.45,16.88 R$21.OUT
DC$22  (via drill 0.2)
  Top 0.125: E$1.DC§22 32.5,19.1 v32.4,19
  Bottom 0.125: v32.4,19 R$22.OUT
DC$23  (via drill 0.2)
  Top 0.125: E$1.DC§23 32.85,19.8 v32.4,20.25
  Bottom 0.125: v32.4,20.25 R$23.OUT
DC$24  (via drill 0.2)
  Top 0.125: E$1.DC§24 33.27,20.5 v32.4,21.38
  Bottom 0.125: v32.4,21.38 30.95,21.38 R$24.OUT
GND  (42 unrouted)
  pour Top (rank 6): -4.85,39.6 81.6,39.7 81.6,-4.7 -4.85,-4.8
  pour Route2 (rank 6): -7.5,41.1 82.1,41.6 82.1,-5.15 -7.5,-5.65
  pour Route15 (rank 6): -11.25,44.5 84.4,44.5 84.4,-11.4 -11.25,-11.4
  pour Route3 (rank 6): -15.4,47.8 85.9,47.8 85.9,-13.85 -15.4,-13.75
  pour Bottom (rank 6): -16.65,49.3 86.65,49.2 86.65,-15.85 -16.65,-15.75
  pour Route14 (rank 6): -12.9,45.3 85.4,45.2 85.4,-12.85 -12.9,-12.75
N$1  (1 unrouted)
N$2  (1 unrouted)
N$3  (1 unrouted)
N$4
  Top 0.3: E$1.RF$04_G2 39.71,23.88 41.9,25.5 B$2.OUT
N$5  (1 unrouted)
N$6  (1 unrouted)
N$7  (1 unrouted)
N$8  (1 unrouted)
N$9  (1 unrouted)
N$10  (1 unrouted)
N$11  (1 unrouted)
N$12
  Top 0.3: B$3.OUT E$1.RF$09_G3
N$13  (1 unrouted)
N$14
  Bottom 0.3: L$2.IN 46.15,24.75 B$8.OUT
N$15  (1 unrouted)
N$16  (1 unrouted)
N$17  (1 unrouted)
N$18  (1 unrouted)
N$19  (1 unrouted)
N$20
  Top 0.3: E$1.RF$21_G6 B$6.OUT
N$21  (1 unrouted)
N$22  (1 unrouted)
N$23  (1 unrouted)
N$25  (1 unrouted)
N$26  (1 unrouted)
RF$3  (1 unrouted)
RF$4
  Bottom 0.3: L$1.IN 30.65,24.75 30.65,27.5 32.65,29.5 45.9,29.5 47.15,28.25 B$7.OUT
S$1  (via drill 0.2)
  Bottom 0.3: v57.02,18 v60.15,18
S$55
  Bottom 0.3: 54.15,26.5 55.65,26.5 56.12,26 56.12,18.75
S$79
  Bottom 0.3: 49.65,11.25 45.9,11.25 44.65,12.5
S$81
  Bottom 0.3: 50.9,11.25 52.4,11.25 52.87,10.75 52.87,10.25
S$82
  Top 0.5: 60.4,18 56.9,18
S$84
  Bottom 0.3: 50.9,7.75 52.4,7.75 52.87,8.25 52.87,8.75
S$86
  Bottom 0.3: 54.15,9.5 55.65,9.5 56.12,10 56.12,17.25
S$89
  Bottom 0.3: 48.4,7.75 47.15,7.75 45.9,6.5 32.65,6.5 30.65,8.5 30.65,11.25 32.15,12.5
S$116  (via drill 0.2)
  other vias: 34.04,14.06
S$145  (via drill 0.2)
  other vias: 42.76,14.06
S$147  (via drill 0.2)
  other vias: 41.65,18.25
S$150  (via drill 0.2)
  other vias: 35.15,18.25
S$155
  Top 0.3: 34.9,28 34.9,25.5 37.09,23.83 37.15,22.75
S$157
  Top 0.3: 37.15,13.25 37.09,12.17 34.9,10.5 34.9,8
S$161
  Top 0.3: 39.65,13.25 39.7,12.17 41.9,10.5
S$164
  Top 0.3: 41.9,10.5 41.9,8
S$165
  cutout Route2: 44.46,9.51 42.9,9.5 32.4,9.5 29.4,12.5 29.4,17.5 35.4,17.5 35.4,18.5 29.4,18.5 29.4,23.5 32.4,26.5 44.4,26.5 47.4,23.5 47.4,18.5 41.4,18.5 41.4,17.5 47.4,17.5 47.4,12.5
  cutout Route3: 44.46,9.51 42.9,9.5 32.4,9.5 29.4,12.5 29.4,17.5 35.4,17.5 35.4,18.5 29.4,18.5 29.4,23.5 32.4,26.5 44.4,26.5 47.4,23.5 47.4,18.5 41.4,18.5 41.4,17.5 47.4,17.5 47.4,12.5
  cutout Route14: 44.46,9.51 42.9,9.5 32.4,9.5 29.4,12.5 29.4,17.5 35.4,17.5 35.4,18.5 29.4,18.5 29.4,23.5 32.4,26.5 44.4,26.5 47.4,23.5 47.4,18.5 41.4,18.5 41.4,17.5 47.4,17.5 47.4,12.5
  cutout Route15: 44.46,9.51 42.9,9.5 32.4,9.5 29.4,12.5 29.4,17.5 35.4,17.5 35.4,18.5 29.4,18.5 29.4,23.5 32.4,26.5 44.4,26.5 47.4,23.5 47.4,18.5 41.4,18.5 41.4,17.5 47.4,17.5 47.4,12.5
  cutout Top: 44.46,9.51 42.9,9.5 32.4,9.5 29.4,12.5 29.4,17.5 35.4,17.5 35.4,18.5 29.4,18.5 29.4,23.5 32.4,26.5 44.4,26.5 47.4,23.5 47.4,18.5 41.4,18.5 41.4,17.5 47.4,17.5 47.4,12.5
  cutout Bottom: 44.46,9.51 42.9,9.5 32.4,9.5 29.4,12.5 29.4,17.5 35.4,17.5 35.4,18.5 29.4,18.5 29.4,23.5 32.4,26.5 44.4,26.5 47.4,23.5 47.4,18.5 41.4,18.5 41.4,17.5 47.4,17.5 47.4,12.5
S$167  (via drill 0.2)
  other vias: 33.7,22.23 33.7,22.23
S$169  (via drill 0.2)
  other vias: 33.7,13.77
S$172  (via drill 0.2)
  other vias: 43.1,13.77
S$173  (via drill 0.2)
  other vias: 42.76,21.94
S$176  (via drill 0.2)
  other vias: 41.65,17.75
S$177  (via drill 0.2)
  other vias: 35.15,17.75
S$210  (via drill 0.2)
  other vias: 58.9,18
S$211  (via drill 0.2)
  other vias: 58.27,18
S$212  (via drill 0.2)
  other vias: 59.52,18
S$213  (via drill 0.2)
  other vias: 57.65,18
S$214  (via drill 0.2)
  other vias: 43.1,22.23
S$215  (via drill 0.2)
  other vias: 34.04,21.94

### Text on the board
tPlace: 4 | 2 | 22 | 24 | 11 | 19 | 21 | 8 | 17 | DESIGN BY J.K. & R.K. | GROUP G. KATSAROS | 15 | RF-BOARD V2.2 / safe ver
bPlace: 5 | 3 | 23 | VB2 / 1 | 18 | 16 | VB1_CL / 13 | 14 | 10 | 6 / VB1_Pi | 9 | 01 | 03 | 02 | 04 | 05 | 06 | 08 | 07 | 10 | 09 | 11 | 12 | 13 | 15 | 14 | 17 | 19 | 16 | 18 | 21 | 20 | 22 | 23 | 24 | 25